# EAGLE design jlpcb-183 (EAGLE 7.3.0)
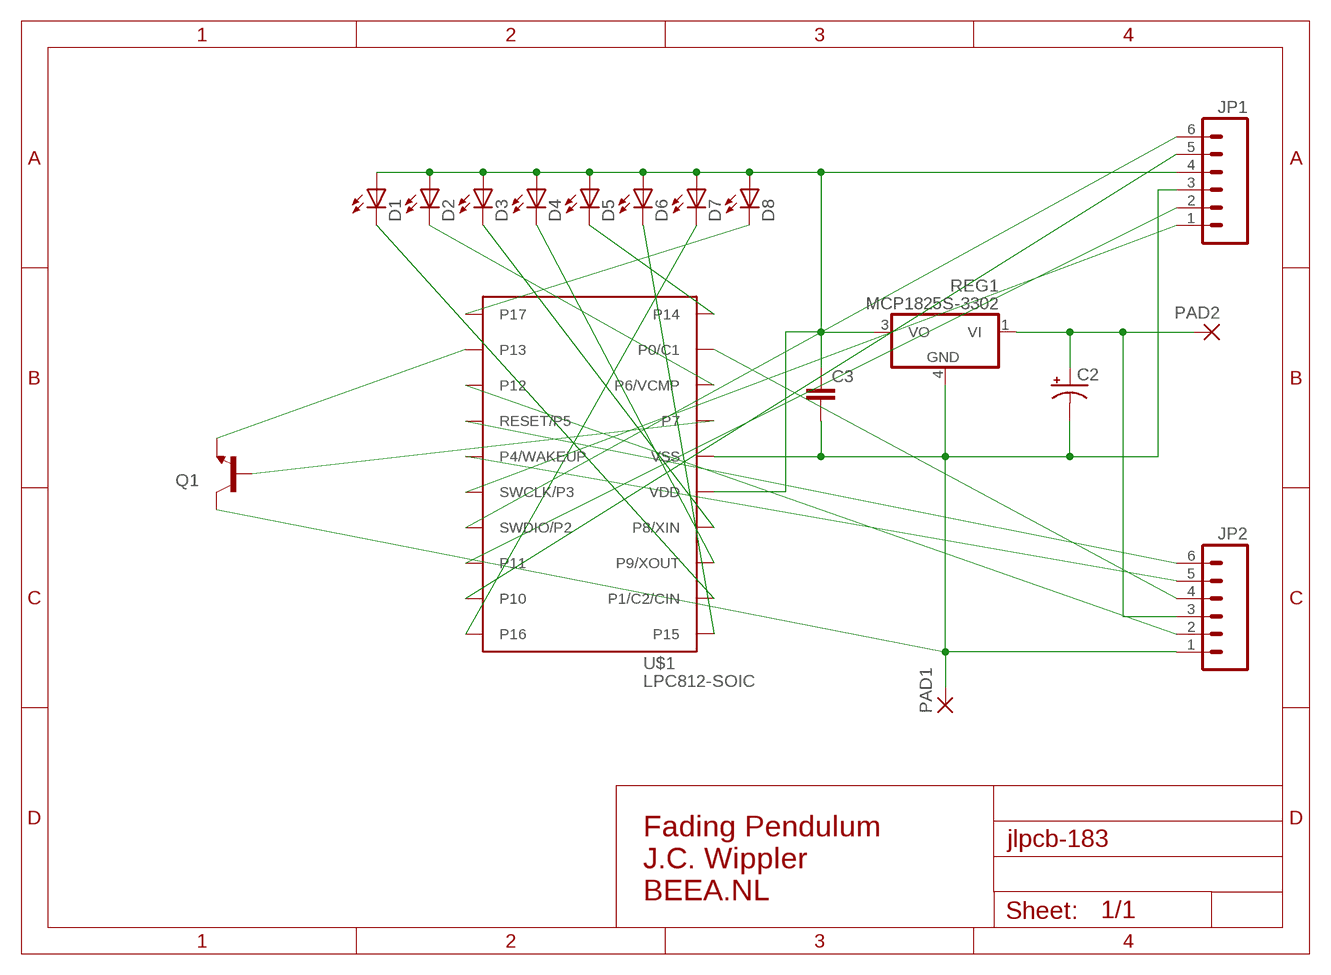
[diagram p0: schematic, sheet 1]

## Parts
C2  CAP_POL1206  [EIA3216]
C3  CAP0805  [0805]
D1  LEDCHIP-LED0805  [CHIP-LED0805]
D2  LEDCHIP-LED0805  [CHIP-LED0805]
D3  LEDCHIP-LED0805  [CHIP-LED0805]
D4  LEDCHIP-LED0805  [CHIP-LED0805]
D5  LEDCHIP-LED0805  [CHIP-LED0805]
D6  LEDCHIP-LED0805  [CHIP-LED0805]
D7  LEDCHIP-LED0805  [CHIP-LED0805]
D8  LEDCHIP-LED0805  [CHIP-LED0805]
JP1  M06NO_SILK_FEMALE_PTH  [1X06_NO_SILK]
JP2  M06NO_SILK_FEMALE_PTH  [1X06_NO_SILK]
PAD1  SMD2  [SMD1,27-2,54]
PAD2  SMD2  [SMD1,27-2,54]
Q1  TRANSISTOR_NPNSOT23-3  [SOT23-3]
REG1  MCP1825S-3302  LM340MP-05  [SOT223]
U$1  LPC812-SOIC  [SOIC20]

## Nets
N$1: D1.C U$1.12(P1/C2/CIN)
N$2: D2.C U$1.18(P6/VCMP)
N$3: D3.C U$1.14(P8/XIN)
N$4: D4.C U$1.13(P9/XOUT)
N$5: D5.C U$1.20(P14)
N$6: D6.C U$1.11(P15)
N$7: D7.C U$1.10(P16)
N$8: D8.C U$1.1(P17)
N$9 [power]: C3.1 D1.A D2.A D3.A D4.A D5.A D6.A D7.A D8.A JP1.4 REG1.3(VO) U$1.15(VDD)
N$10 [power]: C2.C(-) C3.2 JP1.3 JP2.1 PAD1.1(P) Q1.3(C) REG1.4(GND) U$1.16(VSS)
N$11 [power]: C2.A(+) JP2.3 PAD2.1(P) REG1.1(VI)
N$12 [power]: JP2.2 U$1.3(P12)
N$13 [power]: JP2.6 U$1.4(RESET/P5)
N$14: JP2.5 U$1.5(P4/WAKEUP)
N$15: JP2.4 U$1.19(P0/C1)
N$16: JP1.5 U$1.9(P10)
N$17: JP1.2 U$1.8(P11)
N$18: JP1.6 U$1.7(SWDIO/P2)
N$19: JP1.1 U$1.6(SWCLK/P3)
N$20: Q1.2(E) U$1.2(P13)
N$21: Q1.1(B) U$1.17(P7)

## Notes on the sheet
- Fading Pendulum
  J.C. Wippler
  BEEA.NL

## Library data of the parts
C2 = SparkFun-Capacitors:CAP_POL: Capacitor Polarized These are standard SMD and PTH capacitors. Normally 10uF, 47uF, and 100uF in electrolytic and tantalum varieties. Always verify the external diameter of the through hole cap, it varies with capacity, voltage, and manufacturer. The EIA devices should be standard.
C3 = SparkFun-Passives:CAP: Capacitor Standard 0603 ceramic capacitor, and 0.1" leaded capacitor.
D1-D8 = adafruit:LED: LED OSRAM: - CHIPLED LG R971, LG N971, LY N971, LG Q971, LY Q971, LO R971, LY R971 LH N974, LH R974 LS Q976, LO Q976, LY Q976 LO Q996 - Hyper CHIPLED LW Q18S LB Q993, LB Q99A, LB R99A - SideLED LS A670, LO A670, LY A670, LG A670, LP A670 LB A673, LV A673, LT A673, LW A673 LH A674 LY A675 LS A676, LA A676, LO A676, LY A676, LW A676 LS A679, LY A679, LG A679 - Hyper Micro SIDELED® LS Y876, LA Y876, LO Y876, LY Y876 LT Y87S - SmartLED LW L88C, LW L88S LB L89C, LB L89S, LG L890 LS L89K, LO L89K, LY L89K LS L896, LA L896, LO L896, LY L896 - TOPLED LS T670, LO T670, LY T670, LG T670, LP T670 LSG T670, LSP T670, LSY T670, LOP T670, LYG T670 LG T671, LOG T671, LSG T671 LB T673, LV T673, LT T673, LW T673 LH T674 LS T676, LA T676, LO T676, LY T676, LB T676, LH T676, LSB T676, LW T676 LB T67C, LV T67C, LT T67C, LS T67K, LO T67K, LY T67K, LW E67C LS E67B, LA E67B, LO E67B, LY E67B, LB E67C, LV E67C, LT E67C LW T67C LS T679, LY T679, LG T679 LS T770, LO T770, LY T770, LG T770, LP T770 LB T773, LV T773, LT T773, LW T773 LH T774 LS E675, LA E675, LY E675, LS T675 LS T776, LA T776, LO T776, LY T776, LB T776 LHGB T686 LT T68C, LB T68C - Hyper Mini TOPLED® LB M676 - Mini TOPLED Santana® LG M470 LS M47K, LO M47K, LY M47K Source: http://www.osram.convergy.de/
JP1 JP2 = SparkFun-Connectors:M06: Header 6 Standard 6-pin 0.1" header. Use with straight break away headers (SKU : PRT-00116), right angle break away headers (PRT-00553), swiss pins (PRT-00743), machine pins (PRT-00117), and female headers (PRT-00115). Molex polarized connector foot print use with SKU : PRT-08094 with associated crimp pins and housings. NOTES ON THE VARIANTS LOCK and LOCK_LONGPADS... This footprint was designed to help hold the alignment of a through-hole component (i.e. 6-pin header) while soldering it into place. You may notice that each hole has been shifted either up or down by 0.005 of an inch from it's more standard position (which is a perfectly straight line). This slight alteration caused the pins (the squares in the middle) to touch the edges of the holes. Because they are alternating, it causes a "brace" to hold the component in place. 0.005 has proven to be the perfect amount of "off-center" position when using our standard breakaway headers. Although looks a little odd when you look at the bare footprint, once you have a header in there, the alteration is very hard to notice. Also,if you push a header all the way into place, it is covered up entirely on the bottom side. This idea of altering the position of holes to aid alignment will be further integrated into the Sparkfun Library for other footprints. It can help hold any component with 3 or more connection pins.; PROD_ID: CONN-08437
PAD1 PAD2 = wirepad:SMD2: SMD PAD
Q1 = SparkFun-DiscreteSemi:TRANSISTOR_NPN: Generic NPN BJT MMBT2222A - TRANS-08049 (SOT-23, 1A 40V) MPSA42 - TRANS-09116 (SOT-23, 500mA 300V) MMBT5088LT1G - TRANS-11160 (SOT-23, 50 mA 30V) BC547 - COM-08928 <http://www.sparkfun.com/products/8928> (TO-92 45V 100mA) (1.Collector 2.Base 3.Emitter) 2N3904 - COM-00521 <http://www.sparkfun.com/products/521> (TO-92 40V 200mA) (1.Emitter 2.Base 3.Collector) P2N2222A - COM-12852 <http://www.sparkfun.com/products/12852> (TO-92 40V 600mA) (1.Collector 2.Base 3.Emitter); PROD_ID: TRANS-08049
REG1 = linear:LM340?-*: Positive VOLTAGE REGULATOR Source: http://cache.national.com/ds/LM/LM340.pdf
U$1 = JeeLabs:LPC812

## Net classes
1 power: width 0.305 mm

## Board
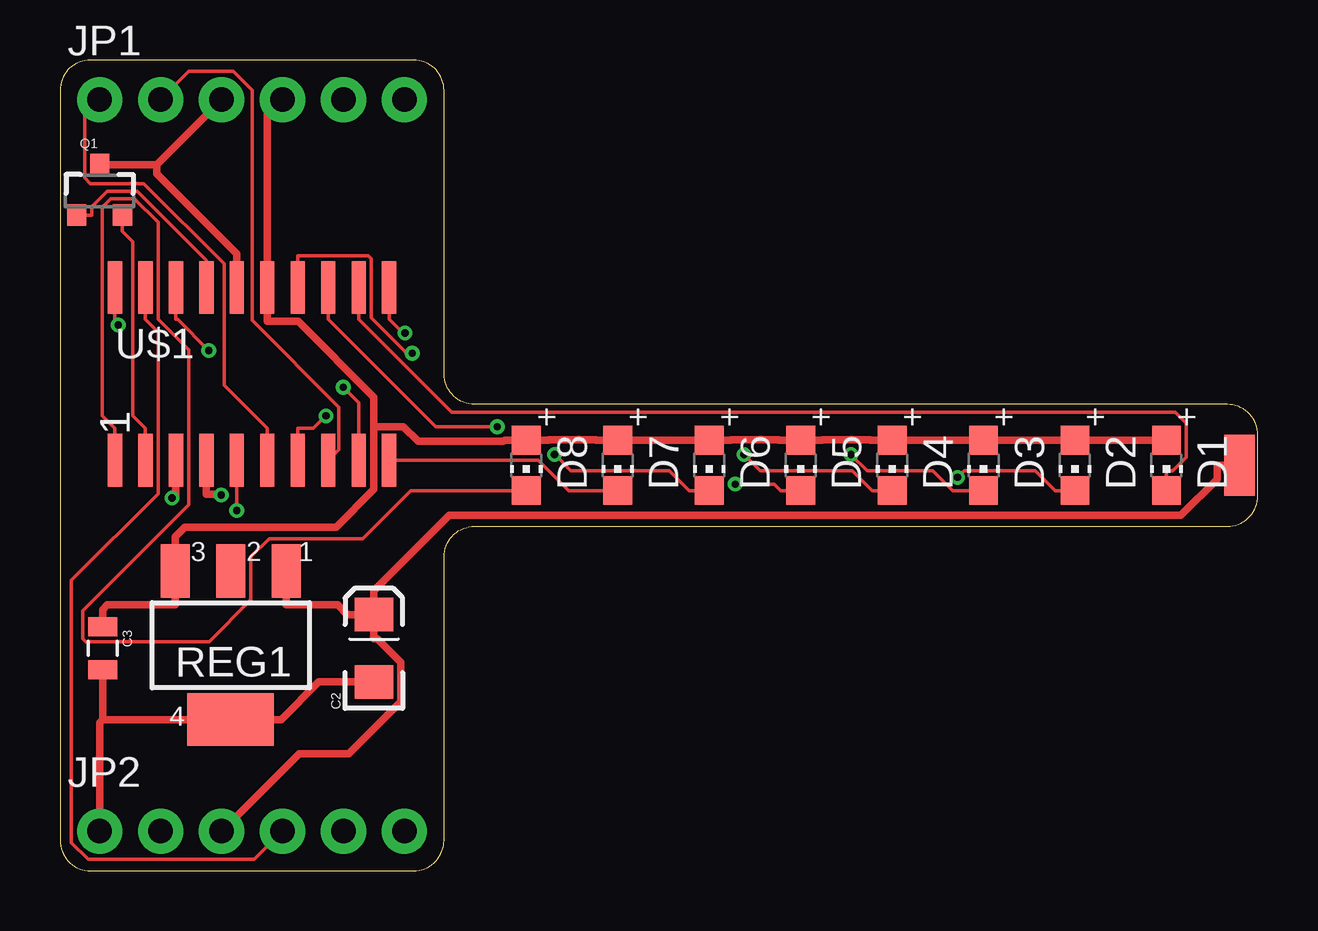
[diagram p1: board, top side]
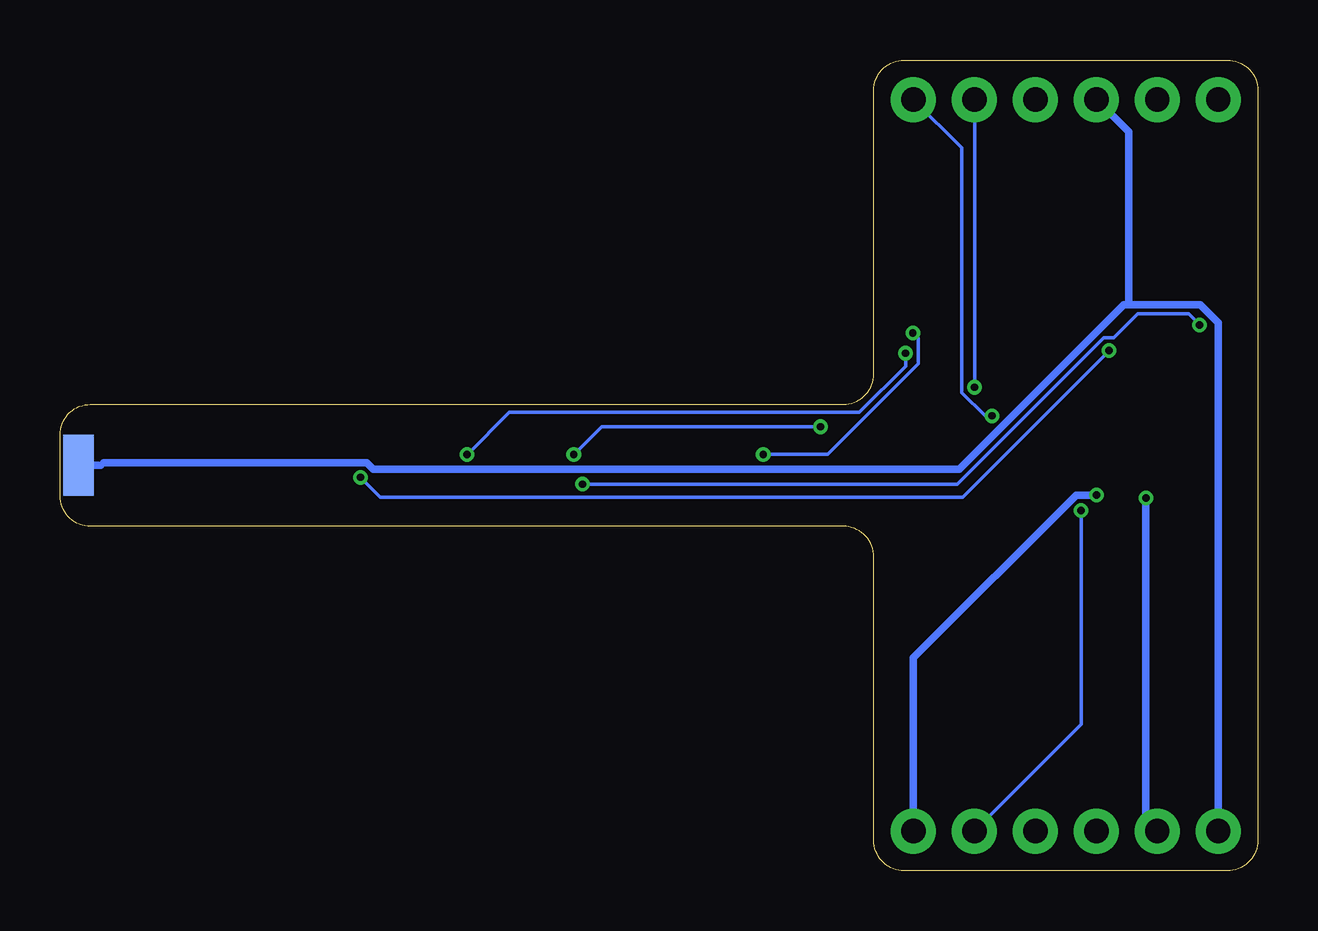
[diagram p2: board, bottom side, seen from below]

Size 49.91 x 33.78 mm. Coordinates in mm from the lower left corner, seen from the top.
Outline: 0,32.51 0,1.27 arc90 1.27,0 14.73,0 arc90 16,1.27 16,13.08 arc-90 17.27,14.35 48.64,14.35 arc90 49.91,15.62 49.91,18.16 arc90 48.64,19.43 17.27,19.43 arc-90 16,20.7 16,32.51 arc90 14.73,33.78 1.27,33.78 arc90 0,32.51
Copper layers (1*16): Top 0.035mm / dielectric 1.5mm / Bottom 0.035mm
Design rules "ITEADstudio_DRC": minimum track width 6mil, minimum drill 12mil, track to track 6mil, track to pad 6mil, pad to pad 6mil, via to via 6mil, smd to smd 0mil, copper to edge 10mil, drill to drill 10mil, minimum pad ring 10mil, minimum via ring 6mil, stop-mask expansion 2mil, vias tented up to drill 100mil, thermal gap 10mil

### Footprints (pad centres in the part's own frame; a part is rotated, then mirrored left to right if it is on the bottom)
EIA3216 = smd 1.4 x 1.6: A 1.4,0; C -1.4,0
0805 = smd 0.8 x 1.2: 1 -0.9,0; 2 0.9,0
CHIP-LED0805 = smd 1.2 x 1.2: A 0,-1.05; C 0,1.05
1X06_NO_SILK = drill 1.016 pad 1.88: 1 0,0; 2 2.54,0; 3 5.08,0; 4 7.62,0; 5 10.16,0; 6 12.7,0
SMD1,27-2,54 = smd 1.27 x 2.54: 1 0,0
SOT23-3 = smd 0.8 x 0.9: 1 -0.95,-1; 2 0.95,-1; 3 0,1.1
SOT223 = smd 1.219 x 2.235: 1 -2.311,-3.099; 2 0,-3.099; 3 2.311,-3.099 | smd 3.6 x 2.2: 4 0,3.099
SOIC20 = smd 0.6 x 2.2: 1 -5.715,-3.6; 2 -4.445,-3.6; 3 -3.175,-3.6; 4 -1.905,-3.6; 5 -0.635,-3.6; 6 0.635,-3.6; 7 1.905,-3.6; 8 3.175,-3.6; 9 4.445,-3.6; 10 5.715,-3.6; 11 5.715,3.6; 12 4.445,3.6; 13 3.175,3.6; 14 1.905,3.6; 15 0.635,3.6; 16 -0.635,3.6; 17 -1.905,3.6; 18 -3.175,3.6; 19 -4.445,3.6; 20 -5.715,3.6

### Placement (x,y rotation side)
C2  13.08,9.27 90 top
C3  1.78,9.27 270 top
D1  46.1,16.89 180 top
D2  42.29,16.89 180 top
D3  38.48,16.89 180 top
D4  34.67,16.89 180 top
D5  30.86,16.89 180 top
D6  27.05,16.89 180 top
D7  23.24,16.89 180 top
D8  19.43,16.89 180 top
JP1  1.65,32.13 0 top
JP2  1.65,1.65 0 top
PAD1  49.15,16.89 0 bottom
PAD2  49.15,16.89 0 top
Q1  1.65,28.32 0 top
REG1  7.11,9.4 180 top
U$1  8,20.7 0 top

### Tracks (layer width: path | path; a pad name or v marks a point on that pad's centre or on a via)
N$1
  Top 0.152: D1.C 46.1,16.67 46.36,16.67 46.93,17.24 46.93,18.64 46.47,19.1 16.32,19.1 12.45,22.97 U$1.12
N$2  (via drill 0.3 pad 0.61)
  Top 0.152: U$1.18 4.83,22.97 4.9,22.97 v6.2,21.67 | D2.C 41.46,15.84 40.63,16.67 37.67,16.67 v37.39,16.39
  Bottom 0.152: v6.2,21.67 12.31,15.57 36.57,15.57 v37.39,16.39
N$3  (via drill 0.3 pad 0.61)
  Top 0.152: v32.95,17.34 33.63,16.67 36.36,16.67 37.19,15.84 37.65,15.84 D3.C | U$1.14 9.91,25.63 12.84,25.63 12.98,25.5 12.98,23.05 14.46,21.56 v14.68,21.56
  Bottom 0.152: v14.68,21.56 14.68,21.03 16.61,19.1 31.2,19.1 v32.95,17.34
N$4  (via drill 0.3 pad 0.61)
  Top 0.152: v18.22,18.5 15.65,18.5 11.18,22.97 U$1.13 | D4.C 33.84,15.84 33.01,16.67 29.18,16.67 v28.51,17.34
  Bottom 0.152: v18.22,18.5 27.34,18.5 v28.51,17.34
N$5  (via drill 0.3 pad 0.61)
  Top 0.152: v28.14,16.11 29.77,16.11 30.03,15.84 D5.C | U$1.20 2.29,22.97 2.43,22.83 v2.43,22.74
  Bottom 0.152: v28.14,16.11 12.53,16.11 6.43,22.21 6,22.21 5,23.2 2.89,23.2 v2.43,22.74
N$6  (via drill 0.3 pad 0.61)
  Top 0.152: v20.61,17.35 21.29,16.67 25.39,16.67 26.22,15.84 D6.C | v14.38,22.41 14.28,22.41 13.72,22.97 U$1.11
  Bottom 0.152: v14.38,22.41 14.15,22.18 14.15,21.13 17.93,17.35 v20.61,17.35
N$7
  Top 0.152: U$1.10 19.93,17.1 21.19,15.84 D7.C
N$8
  Top 0.152: U$1.1 2.29,18.43 1.76,18.96 1.76,27.66 2.1,28 3.1,28 4.08,27.01 4.08,22.97 5.36,21.7 5.36,15.25 0.95,10.84 0.95,9.68 1.08,9.54 6.21,9.54 7.95,11.28 7.95,13.08 8.72,13.84 12.61,13.84 14.61,15.84 D8.C
N$9
  Top 0.305: 13.08,18.51 13.08,15.9 11.5,14.32 5.2,14.32 4.8,13.92 REG1.3 4.8,11.07 1.98,11.07 1.78,10.88 C3.1 | 13.08,18.51 13.08,19.73 9.92,22.9 8.64,22.9 U$1.15 8.64,31.5 JP1.4 | 13.08,18.51 14.3,18.51 14.92,17.89 18.48,17.89 18.53,17.94 D8.A 20.34,17.94 20.36,17.96 22.32,17.96 22.34,17.94 D7.A D6.A 27.96,17.94 27.96,17.95 29.95,17.95 29.96,17.94 D5.A 31.77,17.94 31.78,17.95 33.75,17.95 33.77,17.94 D4.A 35.58,17.94 37.58,17.94 D3.A D2.A D1.A
N$10
  Top 0.305: 4.02,29.42 Q1.3 | JP1.3 4.02,29.42 | 4.02,29.42 4.02,29.05 7.37,25.71 U$1.16 | 1.78,6.3 1.78,7.67 C3.2 | JP2.1 1.65,6.17 1.78,6.3 | 1.78,6.3 5.01,6.3 REG1.4 9.22,6.3 10.79,7.87 C2.C
  Bottom 0.305: 5.39,23.58 5.59,23.58 12.45,16.73 36.87,16.73 37.14,17 48.1,17 48.21,16.89 PAD1.1 | 5.39,23.58 | JP1.3 5.39,30.79 5.39,23.58 | 5.39,23.58 2.4,23.58 1.65,22.83 JP2.1
N$11
  Top 0.305: C2.A 13.08,11.68 16.21,14.81 46.7,14.81 48.21,16.31 48.21,16.89 PAD2.1 | C2.A 11.98,10.67 11.57,11.07 9.42,11.07 REG1.1 | C2.A 13.08,9.67 13.22,9.67 14.19,8.7 14.19,7.05 12.02,4.88 9.96,4.88 JP2.3
N$12  (via drill 0.3 pad 0.61)
  Top 0.305: v4.66,15.53 4.83,15.7 U$1.3
  Bottom 0.305: JP2.2 4.66,2.12 v4.66,15.53
N$13  (via drill 0.3 pad 0.61)
  Top 0.305: v6.72,15.66 6.68,15.7 6.1,15.7 U$1.4
  Bottom 0.305: JP2.6 14.35,8.88 7.58,15.66 v6.72,15.66
N$14  (via drill 0.3 pad 0.61)
  Top 0.152: U$1.5 v7.37,15.01
  Bottom 0.152: JP2.5 7.37,6.1 v7.37,15.01
N$15
  Top 0.152: U$1.19 3.56,22.97 4.08,22.44 4.08,15.71 0.48,12.1 0.48,1.17 1.17,0.48 8.1,0.48 JP2.4
N$16  (via drill 0.3 pad 0.61)
  Top 0.152: v11.8,20.15 12.45,19.51 12.45,18.43 U$1.9
  Bottom 0.152: v11.8,20.15 JP1.5
N$17
  Top 0.152: U$1.8 11.62,17.54 11.62,19.32 8,22.93 8,32.52 7.21,33.3 5.36,33.3 JP1.2
N$18  (via drill 0.3 pad 0.61)
  Top 0.152: v11.08,18.96 10.56,18.43 9.91,18.43 U$1.7
  Bottom 0.152: JP1.6 12.34,30.12 12.34,19.93 11.37,18.96 v11.08,18.96
N$19
  Top 0.152: JP1.1 1.02,31.5 1.02,28.87 1.26,28.63 3.49,28.63 6.84,25.29 6.84,20.23 8.64,18.43 U$1.6
N$20
  Top 0.152: Q1.2 2.6,26.64 3.03,26.22 3.03,18.96 3.56,18.43 U$1.2
N$21
  Top 0.152: U$1.17 6.1,25.43 3.22,28.31 1.98,28.31 1.33,27.66 1.33,27.32 Q1.1